# EAGLE design mega pinout (EAGLE 9.4.2)
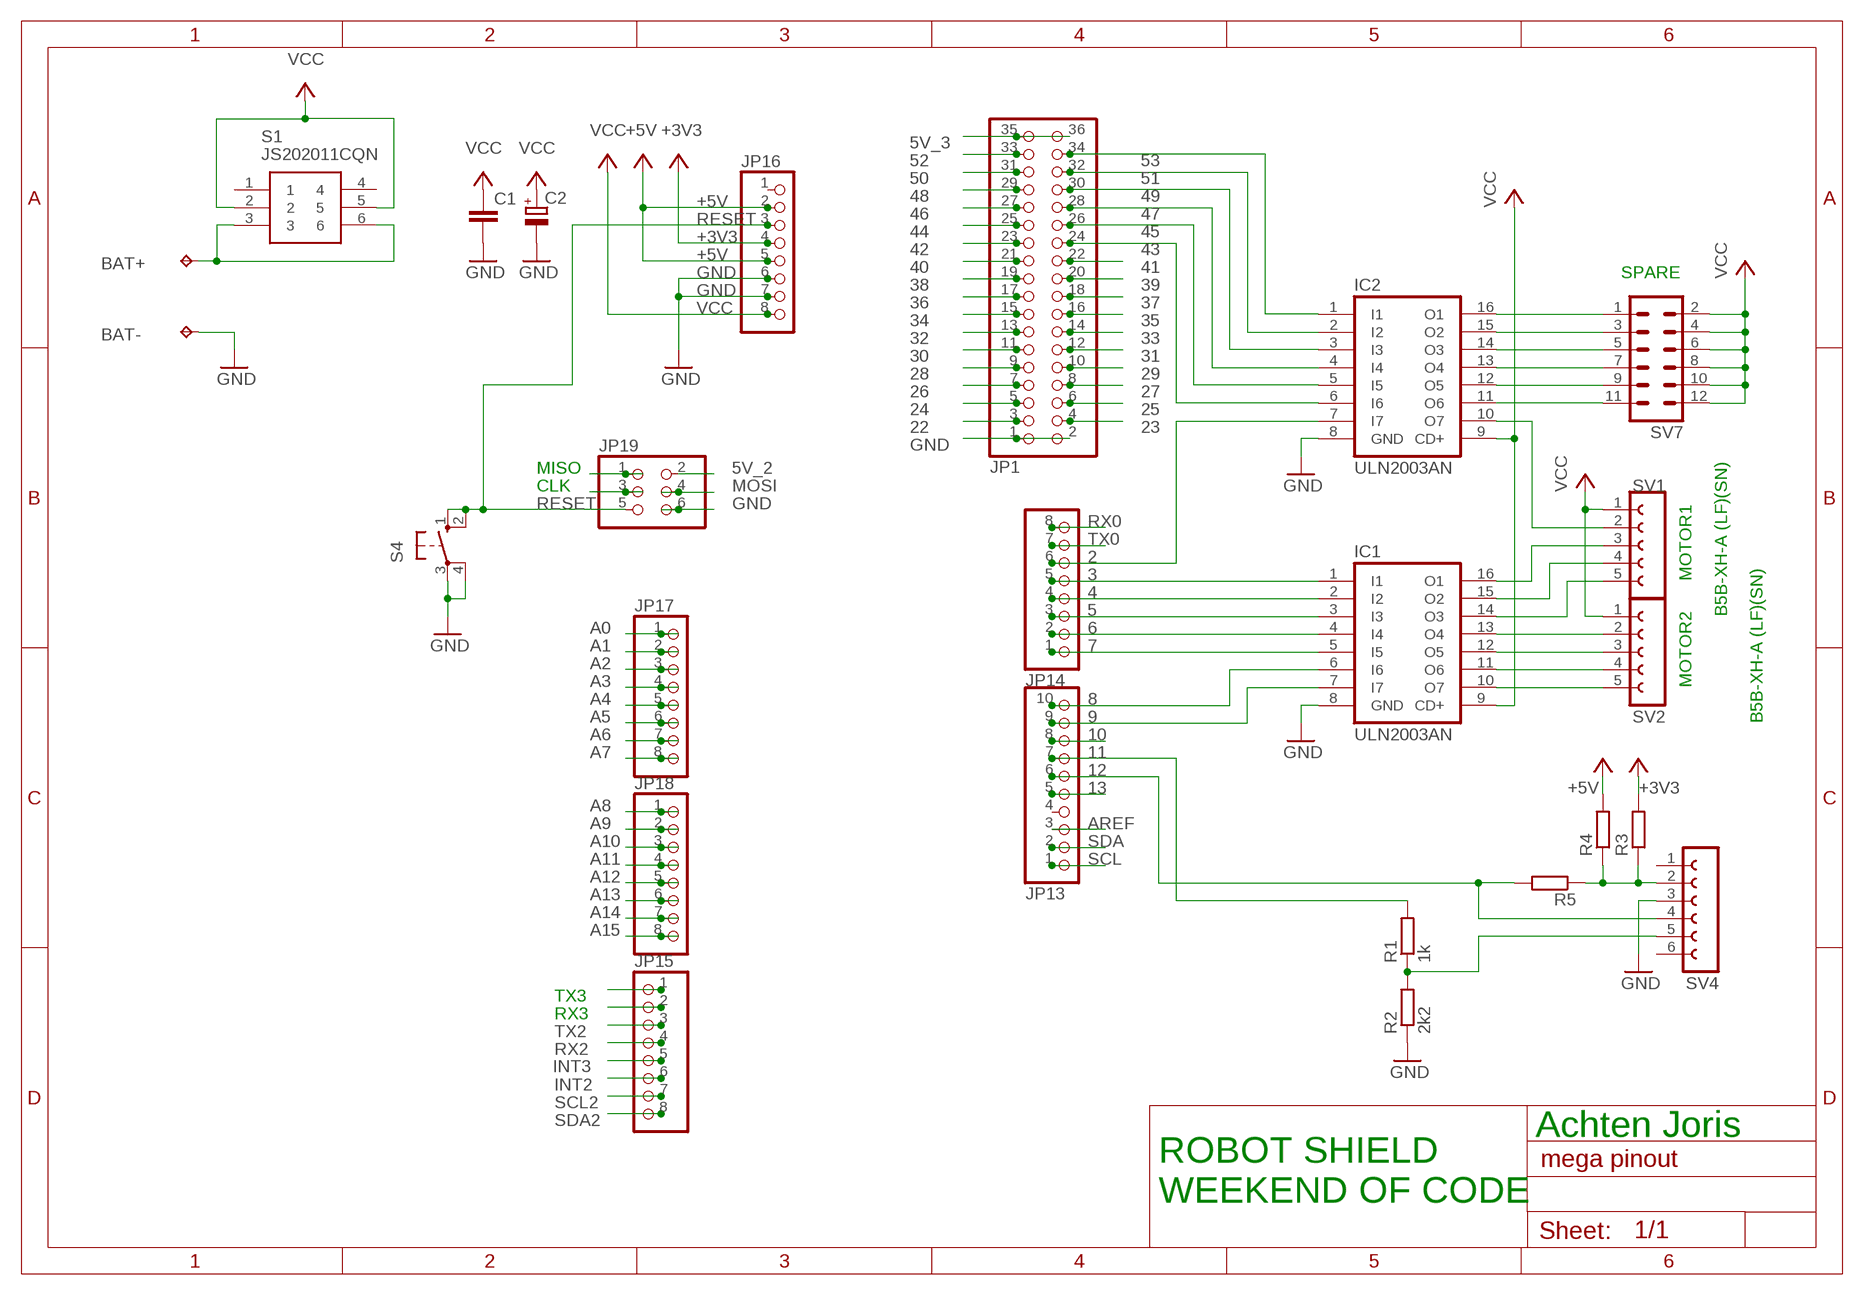
[diagram p0: schematic, sheet 1]

## Parts
BAT+  TPPAD1-13  [P1-13]
BAT-  TPPAD1-13  [P1-13]
C1  C-EUC1206  [C1206]
C2  CPOL-EUE5-8.5  [E5-8,5]
IC1  ULN2003AN  [DIL16]
IC2  ULN2003AN  [DIL16]
JP1  PINHD-2X18  [2X18]
JP13  PINHD-1X10  [1X10]
JP14  PINHD-1X8  [1X08]
JP15  PINHD-1X8  [1X08]
JP16  PINHD-1X8  [1X08]
JP17  PINHD-1X8  [1X08]
JP18  PINHD-1X8  [1X08]
JP19  PINHD-2X3  [2X03]
R1  1k  R-EU_R0603  [R0603]
R2  2k2  R-EU_R0603  [R0603]
R3  R-EU_R0603  [R0603]
R4  R-EU_R0603  [R0603]
R5  R-EU_R0603  [R0603]
S1  JS202011CQN  [JS202011CQN]
S4  10-XX  [B3F-10XX]
SV1  FE05-1  [FE05-1]
SV2  FE05-1  [FE05-1]
SV4  FE06-1  [FE06]
SV7  MA06-2  [MA06-2]

## Nets
2: IC2.7(I7) JP14.6
3: IC1.1(I1) JP14.5
4: IC1.2(I2) JP14.4
5: IC1.3(I3) JP14.3
5V_2: JP19.2
5V_3: JP1.35 JP1.36
6: IC1.4(I4) JP14.2
7: IC1.5(I5) JP14.1
8: IC1.6(I6) JP13.10
9: IC1.7(I7) JP13.9
10: JP13.8
11: JP13.7 R1.2
12: JP13.6 R5.2 SV4.4
13: JP13.5
22: JP1.3
23: JP1.4
24: JP1.5
25: JP1.6
26: JP1.7
27: JP1.8
28: JP1.9
29: JP1.10
30: JP1.11
31: JP1.12
32: JP1.13
33: JP1.14
34: JP1.15
35: JP1.16
36: JP1.17
37: JP1.18
38: JP1.19
39: JP1.20
40: JP1.21
41: JP1.22
42: JP1.23
43: IC2.6(I6) JP1.24
44: JP1.25
45: IC2.5(I5) JP1.26
46: JP1.27
47: IC2.4(I4) JP1.28
48: JP1.29
49: IC2.3(I3) JP1.30
50: JP1.31
51: IC2.2(I2) JP1.32
52: JP1.33
53: IC2.1(I1) JP1.34
+3V3: JP16.4 R3.2
+5V: JP16.2 JP16.5 R4.2
A0: JP17.1
A1: JP17.2
A2: JP17.3
A3: JP17.4
A4: JP17.5
A5: JP17.6
A6: JP17.7
A7: JP17.8
A8: JP18.1
A9: JP18.2
A10: JP18.3
A11: JP18.4
A12: JP18.5
A13: JP18.6
A14: JP18.7
A15: JP18.8
AREF: JP13.3
CLK: JP19.3
GND: BAT-.TP C1.2 C2.- IC1.8(GND) IC2.8(GND) JP1.1 JP1.2 JP16.6 JP16.7 JP19.6 R2.1 S4.3(P) S4.4(P1) SV4.3
INT2: JP15.6
INT3: JP15.5
MISO: JP19.1
MOSI: JP19.4
N$9: BAT+.TP S1.3 S1.6
N$11: R1.1 R2.2 SV4.5
N$18: IC1.10(O7) SV2.5
N$19: IC1.11(O6) SV2.4
N$20: IC1.12(O5) SV2.3
N$21: IC1.13(O4) SV2.2
N$22: IC1.14(O3) SV1.5
N$23: IC1.15(O2) SV1.4
N$24: IC1.16(O1) SV1.3
N$25: IC2.10(O7) SV1.2
N$26: IC2.16(O1) SV7.1
N$27: IC2.15(O2) SV7.3
N$28: IC2.14(O3) SV7.5
N$29: IC2.13(O4) SV7.7
N$30: IC2.12(O5) SV7.9
N$31: IC2.11(O6) SV7.11
N$89: R3.1 R4.1 R5.1 SV4.2
RESET: JP16.3 JP19.5 S4.1(S) S4.2(S1)
RX0: JP14.8
RX2: JP15.4
RX3: JP15.2
SCL: JP13.1
SCL2: JP15.7
SDA: JP13.2
SDA2: JP15.8
TX0: JP14.7
TX2: JP15.3
TX3: JP15.1
VCC: C1.1 C2.+ IC1.9(CD+) IC2.9(CD+) JP16.8 S1.2 S1.5 SV1.1 SV2.1 SV7.2 SV7.4 SV7.6 SV7.8 SV7.10 SV7.12
Unconnected: JP13.4 JP16.1 S1.1 S1.4 SV4.1 SV4.6

## Notes on the sheet
- SPARE
- MOTOR1
- B5B-XH-A (LF)(SN)
- MOTOR2
- B5B-XH-A (LF)(SN)
- Achten Joris
- ROBOT SHIELD
  WEEKEND OF CODE

## Library data of the parts
BAT+ BAT- = testpad:TP: Test pad
C1 = rcl:C-EU: CAPACITOR, European symbol; SPICEPREFIX: C
C2 = rcl:CPOL-EU: POLARIZED CAPACITOR, European symbol; SPICEPREFIX: C
IC1 IC2 = uln-udn:ULN2003A: DRIVER ARRAY
JP1 = pinhead:PINHD-2X18: PIN HEADER
JP13 = pinhead:PINHD-1X10: PIN HEADER
JP14-JP18 = pinhead:PINHD-1X8: PIN HEADER
JP19 = pinhead:PINHD-2X3: PIN HEADER
R1-R5 = rcl:R-EU_: RESISTOR, European symbol; SPICEPREFIX: R
S1 = SamacSys_Parts:JS202011CQN: Slide Switches DPDT THRU HOLE .3A Source: Datasheet <https://componentsearchengine.com/Datasheets/1/JS202011CQN.pdf>; DESCRIPTION: Slide Switches DPDT THRU HOLE .3A; HEIGHT: mm; MANUFACTURER_NAME: C & K COMPONENTS; MANUFACTURER_PART_NUMBER: JS202011CQN; MOUSER_PART_NUMBER: 611-JS202011CQN; MOUSER_PRICE-STOCK: https://www.mouser.com/Search/Refine.aspx?Keyword=611-JS202011CQN
S4 = switch-omron:10-XX: OMRON SWITCH; MPN: B3F-1000; OC_FARNELL: 176432; OC_NEWARK: 36M3542
SV1 SV2 = con-lsta:FE05-1: FEMALE HEADER; OC_FARNELL: unknown; OC_NEWARK: unknown
SV4 = con-lsta:FE06-1: FEMALE HEADER; OC_FARNELL: unknown; OC_NEWARK: unknown
SV7 = con-lstb:MA06-2: PIN HEADER; OC_FARNELL: unknown; OC_NEWARK: unknown

## Net classes
1 vcc: width 0.305 mm

## Board
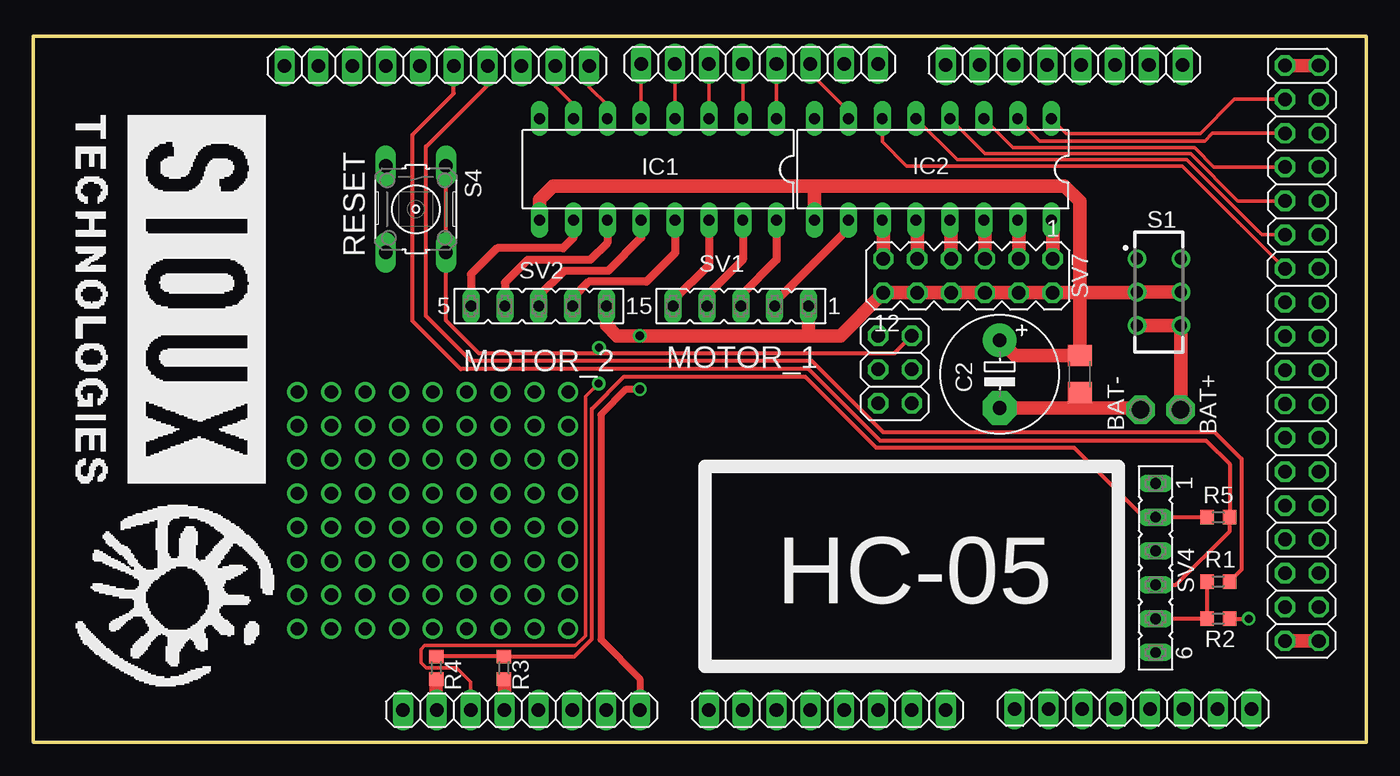
[diagram p1: board, top side]
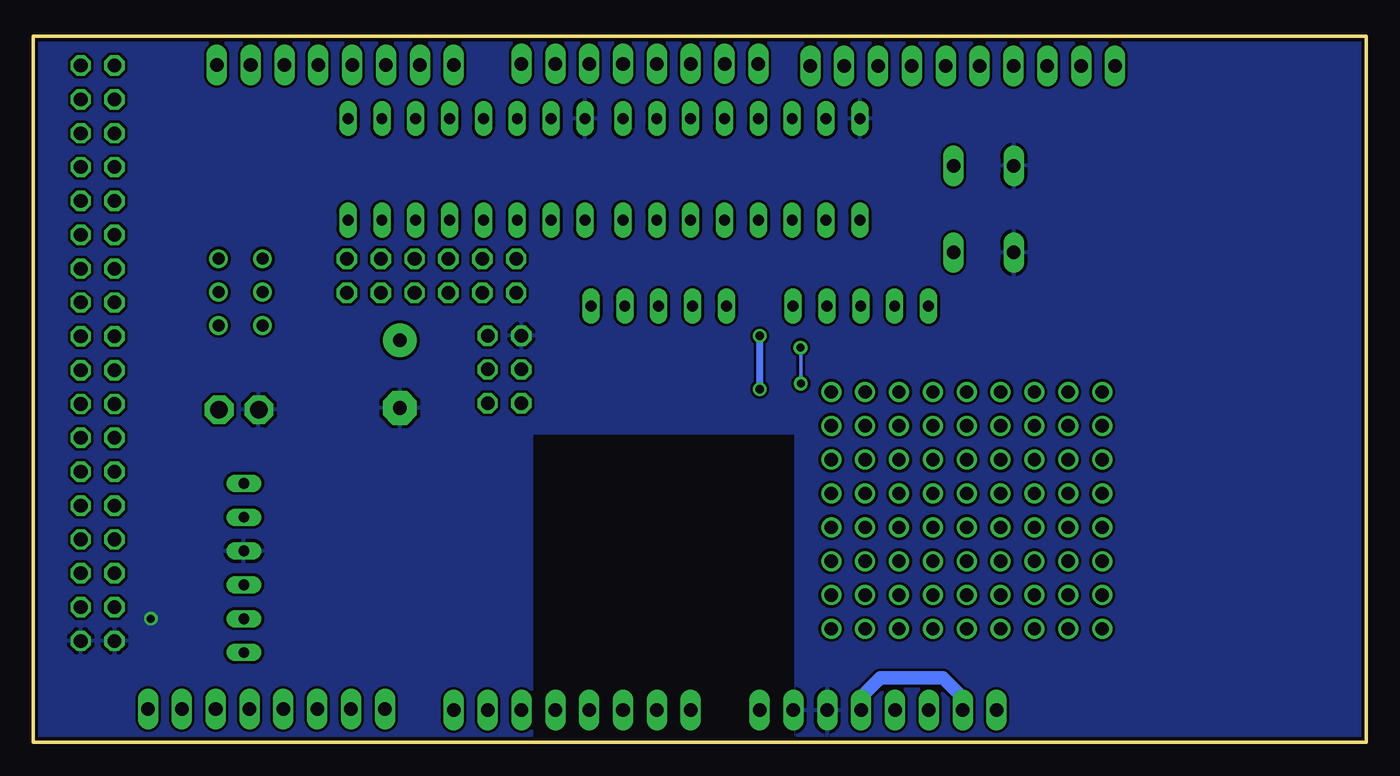
[diagram p2: board, bottom side, seen from below]

Size 100 x 53 mm. Coordinates in mm from the lower left corner, seen from the top.
Outline: 0,0 100,0 100,53 0,53 0,0
Copper layers (1*16): Top 0.035mm / dielectric 1.5mm / Bottom 0.035mm
Design rules "default *": minimum track width 10mil, minimum drill 24mil, track to track 8mil, track to pad 8mil, pad to pad 8mil, via to via 8mil, smd to smd 8mil, copper to edge 10mil, drill to drill 8mil, minimum pad ring 10mil, minimum via ring 8mil, stop-mask expansion 4mil, vias tented up to drill 0mil, thermal gap 10mil

### Footprints (pad centres in the part's own frame; a part is rotated, then mirrored left to right if it is on the bottom)
P1-13 = drill 1.321 pad 2.159 octagon: TP 0,0
C1206 = smd 1.6 x 1.8: 1 -1.4,0; 2 1.4,0
E5-8,5 = drill 1.016 pad 2.54: + -2.54,0 | drill 1.016 pad 2.54 octagon: - 2.54,0
DIL16 = drill 0.813 long: 1 -8.89,-3.81; 2 -6.35,-3.81; 3 -3.81,-3.81; 4 -1.27,-3.81; 5 1.27,-3.81; 6 3.81,-3.81; 7 6.35,-3.81; 8 8.89,-3.81; 9 8.89,3.81; 10 6.35,3.81; 11 3.81,3.81; 12 1.27,3.81; 13 -1.27,3.81; 14 -3.81,3.81; 15 -6.35,3.81; 16 -8.89,3.81
2X18 = drill 1.016 octagon: 1 -21.59,-1.27; 2 -21.59,1.27; 3 -19.05,-1.27; 4 -19.05,1.27; 5 -16.51,-1.27; 6 -16.51,1.27; 7 -13.97,-1.27; 8 -13.97,1.27; 9 -11.43,-1.27; 10 -11.43,1.27; 11 -8.89,-1.27; 12 -8.89,1.27; 13 -6.35,-1.27; 14 -6.35,1.27; 15 -3.81,-1.27; 16 -3.81,1.27; 17 -1.27,-1.27; 18 -1.27,1.27; 19 1.27,-1.27; 20 1.27,1.27; 21 3.81,-1.27; 22 3.81,1.27; 23 6.35,-1.27; 24 6.35,1.27; 25 8.89,-1.27; 26 8.89,1.27; 27 11.43,-1.27; 28 11.43,1.27; 29 13.97,-1.27; 30 13.97,1.27; 31 16.51,-1.27; 32 16.51,1.27; 33 19.05,-1.27; 34 19.05,1.27; 35 21.59,-1.27; 36 21.59,1.27
1X10 = drill 1.016 long: 1 -11.43,0; 2 -8.89,0; 3 -6.35,0; 4 -3.81,0; 5 -1.27,0; 6 1.27,0; 7 3.81,0; 8 6.35,0; 9 8.89,0; 10 11.43,0
1X08 = drill 1.016 long: 1 -8.89,0; 2 -6.35,0; 3 -3.81,0; 4 -1.27,0; 5 1.27,0; 6 3.81,0; 7 6.35,0; 8 8.89,0
2X03 = drill 1.016 octagon: 1 -2.54,-1.27; 2 -2.54,1.27; 3 0,-1.27; 4 0,1.27; 5 2.54,-1.27; 6 2.54,1.27
R0603 = smd 1 x 1.1: 1 -0.85,0; 2 0.85,0
JS202011CQN = drill 0.9 pad 1.4: 1 -2.5,-1.65; 2 0,-1.65; 3 2.5,-1.65; 4 -2.5,1.65; 5 0,1.65; 6 2.5,1.65
B3F-10XX = drill 1.016 long: 1 -3.251,2.261; 2 3.251,2.261; 3 -3.251,-2.261; 4 3.251,-2.261
FE05-1 = drill 0.813 long: 1 -5.08,0; 2 -2.54,0; 3 0,0; 4 2.54,0; 5 5.08,0
FE06 = drill 0.813 long: 1 -6.35,0; 2 -3.81,0; 3 -1.27,0; 4 1.27,0; 5 3.81,0; 6 6.35,0
MA06-2 = drill 1.016 octagon: 1 -6.35,-1.27; 2 -6.35,1.27; 3 -3.81,-1.27; 4 -3.81,1.27; 5 -1.27,-1.27; 6 -1.27,1.27; 7 1.27,-1.27; 8 1.27,1.27; 9 3.81,-1.27; 10 3.81,1.27; 11 6.35,-1.27; 12 6.35,1.27

### Placement (x,y rotation side)
BAT+  86.07,24.96 270 top
BAT-  83.08,24.96 270 top
C1  78.5,27.62 270 top
C2  72.5,27.62 270 top
IC1  46.88,43 180 top
IC2  67.5,43 180 top
JP1  95.17,29.19 90 top
JP13  30.27,50.75 0 top
JP14  54.49,50.92 0 top
JP15  77.34,50.83 0 top
JP16  36.62,2.41 0 top
JP17  59.57,2.41 0 top
JP18  82.51,2.49 0 top
JP19  64.65,27.98 90 top
R1  88.9,12.06 0 top
R2  88.9,9.27 180 top
R3  35.31,5.59 270 top
R4  30.23,5.59 270 top
R5  88.9,16.89 0 top
S1  84.45,33.78 270 top
S4  28.7,40.01 270 top
SV1  53.08,32.73 180 top
SV2  37.92,32.73 180 top
SV4  84.2,13.08 270 top
SV7  70.12,35 180 top

### Tracks (layer width: path | path; a pad name or v marks a point on that pad's centre or on a via)
2
  Top 0.254: JP14.6 58.3,50.2 61.15,47.35 IC2.7
3
  Top 0.254: JP14.5 55.76,46.82 IC1.1
4
  Top 0.254: JP14.4 IC1.2
5
  Top 0.254: IC1.3 JP14.3
5V_3
  Top 1.016: JP1.36 JP1.35
6
  Top 0.254: JP14.2 48.14,46.82 IC1.4
7
  Top 0.254: JP14.1 IC1.5
8
  Top 0.254: IC1.6 43.06,47.81 41.7,49.17 JP13.10
9
  Top 0.254: IC1.7 40.52,47.85 39.16,49.21 JP13.9
11
  Top 0.305: JP13.7 34.09,49.33 29.46,44.7 29.46,32 32.85,28.62 58.42,28.62 63.78,23.26 88.66,23.26 90.64,21.28 90.64,12.95 R1.2
12
  Top 0.305: JP13.6 31.55,48.69 28.45,45.59 28.45,31.62 32.07,28 58.17,28 63.53,22.64 87.98,22.64 89.75,20.87 R5.2 89.75,15.84 85.72,11.81 SV4.4
43
  Top 0.254: IC2.6 63.69,45.06 65.5,43.25 86.19,43.25 JP1.24
45
  Top 0.254: IC2.5 69.33,43.71 86.53,43.71 92.15,38.09 JP1.26
47
  Top 0.254: IC2.4 71.41,44.17 86.83,44.17 90.38,40.62 JP1.28
49
  Top 0.254: IC2.3 73.5,44.62 87.12,44.62 88.58,43.16 JP1.30
51
  Top 0.254: IC2.2 75.53,45.12 87.88,45.12 88.45,45.7 JP1.32
53
  Top 0.254: IC2.1 77.52,45.69 87.56,45.69 90.12,48.24 JP1.34
+3V3
  Top 1.016: R3.2 35.35,4.69 JP16.4
+5V
  Top 1.016: R4.2 30.23,2.46 JP16.2
  Bottom 1.016: JP16.5 37.89,3.38 36.45,4.83 31.75,4.83 30.27,3.35 JP16.2
GND  (via drill 0.61)
  Top 0.305: R2.1 v91.19,9.27
  Top 1.016: C2.- 78.49,25.09 | 78.49,25.09 82.95,25.09 BAT-.TP | JP1.2 JP1.1 | C1.2 78.5,25.1 78.49,25.09
  pour Bottom: 0.13,0.13 0.13,52.96 99.95,52.96 99.95,0 62.61,0.11 62.61,23.24 42.8,23.24 42.8,0.13
N$1  (via drill 1)
  other vias: 29.97,8.51
N$2  (via drill 1)
  other vias: 29.97,11.05
N$3  (via drill 1)
  other vias: 29.97,13.59
N$4  (via drill 1)
  other vias: 29.97,16.13
N$5  (via drill 1)
  other vias: 29.97,18.67
N$6  (via drill 1)
  other vias: 29.97,21.21
N$7  (via drill 1)
  other vias: 29.97,23.75
N$8  (via drill 1)
  other vias: 29.97,26.29
N$9
  Top 1.016: S1.3 S1.6 86.11,24.99 BAT+.TP
N$10  (via drill 1)
  other vias: 32.51,26.29
N$11
  Top 0.305: R1.1 R2.2 SV4.5
N$12  (via drill 1)
  other vias: 32.51,23.75
N$13  (via drill 1)
  other vias: 32.51,21.21
N$14  (via drill 1)
  other vias: 32.51,18.67
N$15  (via drill 1)
  other vias: 32.51,16.13
N$16  (via drill 1)
  other vias: 32.51,13.59
N$17  (via drill 1)
  other vias: 32.51,11.05
N$18
  Top 0.61: IC1.10 40.52,37.86 39.75,37.08 34.8,37.08 32.84,35.13 SV2.5
N$19
  Top 0.61: IC1.11 43.06,37.47 41.78,36.19 37.09,36.19 37.08,36.2 35.38,34.49 SV2.4
N$20
  Top 0.61: IC1.12 45.6,37.86 43.12,35.38 39.82,35.38 37.92,33.48 SV2.3
N$21
  Top 0.61: IC1.13 48.15,36.72 45.99,34.56 41.67,34.56 40.46,33.35 SV2.2
N$22
  Top 0.61: IC1.14 50.69,35.83 48,33.14 SV1.5
N$23
  Top 0.61: IC1.15 53.23,36.21 50.54,33.52 SV1.4
N$24
  Top 0.61: IC1.16 55.77,36.21 53.08,33.52 SV1.3
N$25
  Top 0.61: IC2.10 61.15,38.54 55.62,33.02 SV1.2
N$26
  Top 1.016: SV7.1 76.47,39.1 IC2.16
N$27
  Top 1.016: SV7.3 73.94,39.1 IC2.15
N$28
  Top 1.016: SV7.5 71.39,39.1 IC2.14
N$29
  Top 1.016: IC2.13 68.86,39.1 SV7.7
N$30
  Top 1.016: IC2.12 66.31,39.1 SV7.9
N$31
  Top 1.016: IC2.11 63.77,39.1 SV7.11
N$32  (via drill 1)
  other vias: 32.51,8.51
N$33  (via drill 1)
  other vias: 35.05,8.51
N$34  (via drill 1)
  other vias: 35.05,11.05
N$35  (via drill 1)
  other vias: 35.05,13.59
N$36  (via drill 1)
  other vias: 35.05,16.13
N$37  (via drill 1)
  other vias: 35.05,18.67
N$38  (via drill 1)
  other vias: 35.05,21.21
N$39  (via drill 1)
  other vias: 35.05,23.75
N$40  (via drill 1)
  other vias: 35.05,26.29
N$41  (via drill 1)
  other vias: 37.59,26.29
N$42  (via drill 1)
  other vias: 37.59,23.75
N$43  (via drill 1)
  other vias: 37.59,21.21
N$44  (via drill 1)
  other vias: 37.59,18.67
N$45  (via drill 1)
  other vias: 37.59,16.13
N$46  (via drill 1)
  other vias: 37.59,13.59
N$47  (via drill 1)
  other vias: 37.59,11.05
N$48  (via drill 1)
  other vias: 37.59,8.51
N$49  (via drill 1)
  other vias: 19.81,8.51
N$50  (via drill 1)
  other vias: 19.81,11.05
N$51  (via drill 1)
  other vias: 19.81,13.59
N$52  (via drill 1)
  other vias: 19.81,16.13
N$53  (via drill 1)
  other vias: 19.81,18.67
N$54  (via drill 1)
  other vias: 19.81,21.21
N$55  (via drill 1)
  other vias: 19.81,23.75
N$56  (via drill 1)
  other vias: 19.81,26.29
N$57  (via drill 1)
  other vias: 22.35,26.29
N$58  (via drill 1)
  other vias: 22.35,23.75
N$59  (via drill 1)
  other vias: 22.35,21.21
N$60  (via drill 1)
  other vias: 22.35,18.67
N$61  (via drill 1)
  other vias: 22.35,16.13
N$62  (via drill 1)
  other vias: 22.35,13.59
N$63  (via drill 1)
  other vias: 22.35,11.05
N$64  (via drill 1)
  other vias: 22.35,8.51
N$65  (via drill 1)
  other vias: 24.89,8.51
N$66  (via drill 1)
  other vias: 24.89,11.05
N$67  (via drill 1)
  other vias: 24.89,13.59
N$68  (via drill 1)
  other vias: 24.89,16.13
N$69  (via drill 1)
  other vias: 24.89,18.67
N$70  (via drill 1)
  other vias: 24.89,21.21
N$71  (via drill 1)
  other vias: 24.89,23.75
N$72  (via drill 1)
  other vias: 24.89,26.29
N$73  (via drill 1)
  other vias: 27.43,26.29
N$74  (via drill 1)
  other vias: 27.43,23.75
N$75  (via drill 1)
  other vias: 27.43,21.21
N$76  (via drill 1)
  other vias: 27.43,18.67
N$77  (via drill 1)
  other vias: 27.43,16.13
N$78  (via drill 1)
  other vias: 27.43,13.59
N$79  (via drill 1)
  other vias: 27.43,11.05
N$80  (via drill 1)
  other vias: 27.43,8.51
N$81  (via drill 1)
  other vias: 40.13,26.29
N$82  (via drill 1)
  other vias: 40.13,23.75
N$83  (via drill 1)
  other vias: 40.13,21.21
N$84  (via drill 1)
  other vias: 40.13,18.67
N$85  (via drill 1)
  other vias: 40.13,16.13
N$86  (via drill 1)
  other vias: 40.13,13.59
N$87  (via drill 1)
  other vias: 40.13,11.05
N$88  (via drill 1)
  other vias: 40.13,8.51
N$89
  Top 0.305: R4.1 R3.1 40.6,6.44 41.91,7.75 41.91,25.02 44.32,27.43 57.91,27.43 63.25,22.1 78.11,22.1 83.31,16.89 SV4.2 R5.1
RESET  (via drill 0.61)
  Top 0.254: JP16.3 32.81,4.52 31.75,5.59 29.46,5.59 29.08,5.97 29.08,6.99 29.37,7.27 40.7,7.27 41.43,8 41.43,25.93 v42.42,26.92 | v42.45,29.62 42.45,29.21
  Top 0.305: JP19.5 64.61,29.21 42.45,29.21 33.41,29.21 30.96,31.66 S4.2 S4.1
  Bottom 0.254: v42.42,26.92 42.42,29.64 v42.45,29.62
VCC  (via drill 0.61)
  Top 0.508: v45.5,26.49 44.48,26.49 42.58,24.59 42.58,7.71 45.51,4.78 JP16.8
  Top 1.016: 58.5,41.75 77.34,41.75 78.5,40.59 78.5,33.74 | 58.5,41.75 39,41.75 37.98,40.73 IC1.9 | IC2.9 58.61,41.64 58.5,41.75 | 58.17,30.5 v45.5,30.5 43.8,30.5 43,31.3 SV2.1 | SV1.1 58.16,30.5 58.17,30.5 | 58.17,30.5 60.55,30.5 SV7.12 SV7.10 SV7.8 SV7.6 SV7.4 SV7.2 78.49,33.73 | C2.+ 73.64,29.02 C1.1 78.5,33.74 | 78.49,33.73 82.75,33.73 S1.2 S1.5 | 78.49,33.73 78.5,33.74
  Bottom 0.508: v45.5,26.49 v45.5,30.5

### Text on the board
tNames: RESET | MOTOR_2 | MOTOR_1 | HC-05